# Altium schematic sheet LED_Controller_Power.SchDoc
size A4
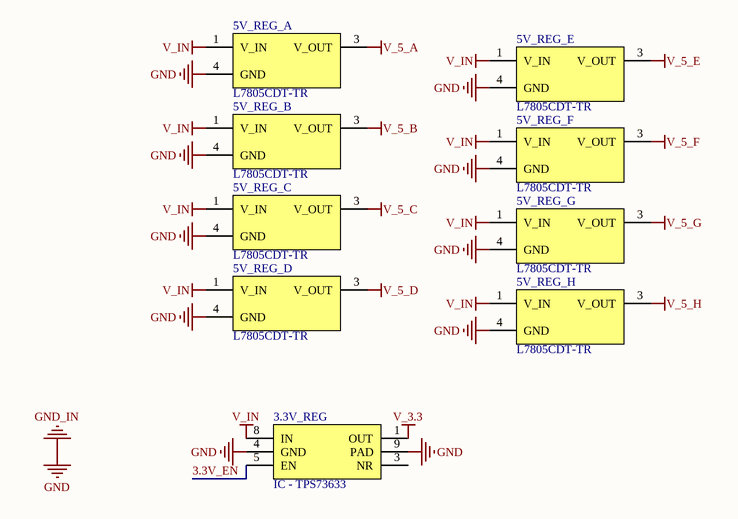
[diagram p0: LED_Controller_Power.SchDoc]

## Parts
3.3V_REG  IC - TPS73633  [TI - DRB / QFN65P300X300X100-8L]
5V_REG_A  L7805CDT-TR  [TO228P973X240-3N]
5V_REG_B  L7805CDT-TR  [TO228P973X240-3N]
5V_REG_C  L7805CDT-TR  [TO228P973X240-3N]
5V_REG_D  L7805CDT-TR  [TO228P973X240-3N]
5V_REG_E  L7805CDT-TR  [TO228P973X240-3N]
5V_REG_F  L7805CDT-TR  [TO228P973X240-3N]
5V_REG_G  L7805CDT-TR  [TO228P973X240-3N]
5V_REG_H  L7805CDT-TR  [TO228P973X240-3N]

## Nets
GND: 3.3V_REG.4(GND) 3.3V_REG.9(PAD) 5V_REG_A.4(GND) 5V_REG_B.4(GND) 5V_REG_C.4(GND) 5V_REG_D.4(GND) 5V_REG_E.4(GND) 5V_REG_F.4(GND) 5V_REG_G.4(GND) 5V_REG_H.4(GND)  [also labelled GND_IN]
V_3.3: 3.3V_REG.1(OUT)
V_5_A: 5V_REG_A.3(V_OUT)
V_5_B: 5V_REG_B.3(V_OUT)
V_5_C: 5V_REG_C.3(V_OUT)
V_5_D: 5V_REG_D.3(V_OUT)
V_5_E: 5V_REG_E.3(V_OUT)
V_5_F: 5V_REG_F.3(V_OUT)
V_5_G: 5V_REG_G.3(V_OUT)
V_5_H: 5V_REG_H.3(V_OUT)
V_IN: 3.3V_REG.8(IN) 5V_REG_A.1(V_IN) 5V_REG_B.1(V_IN) 5V_REG_C.1(V_IN) 5V_REG_D.1(V_IN) 5V_REG_E.1(V_IN) 5V_REG_F.1(V_IN) 5V_REG_G.1(V_IN) 5V_REG_H.1(V_IN)
3.3V_EN: 3.3V_REG.5(EN)

Not connected (* = marked no-connect by the designer): 3.3V_REG 3(NR)

## Library data of the parts
3.3V_REG = IC - TPS73633: IC LDO REG 400MA NO CAP 8-SON; Manufacturer: Texas Instruments; Manufacturer Part Number: TPS73633DRBR; Regulator Topology: Positive Fixed; Voltage - Output: 3.3V; Voltage - Input: Up to 5.5V; Voltage - Dropout (Typical): 0.075V @ 400mA; Number of Regulators: 1; Current - Output: 400mA (Max); Supplier 1: Digi-Key; RoHS: RoHS Compliant; Category: Integrated Circuits (ICs); Stock 1: 6005; Pricing 1: 1=3.15, 25=2.43, 100=2.205, 250=1.98, 500=1.71, 1000=1.44 (USD); Current - Limit (Min): 400mA; Operating Temperature: -40°C ~ 125°C; Mounting Type: Surface Mount; Package / Case: 8-VDFN Exposed Pad; Supplier Device Package: 8-SON Exposed Pad (3x3); Packaging: Cut Tape (CT); ComponentLink1URL: http://focus.ti.com/lit/ds/symlink/tps73601.pdf; ComponentLink1Description: http://focus.ti.com/lit/ds/symlink/tps73601.pdf; Supplier Part Number 1: 296-17884-1-ND
5V_REG_A 5V_REG_B 5V_REG_C 5V_REG_D 5V_REG_E 5V_REG_F 5V_REG_G 5V_REG_H = IC - L7805CDT-TR: IC REG POS 1.5A 5V PREC DPAK; Manufacturer: STMicroelectronics; Regulator Topology: Positive Fixed; Voltage - Input: Up to 35V; Voltage - Dropout (Typical): 2V @ 1A; Number of Regulators: 1; Supplier 1: Digi-Key; Manufacturer Part Number: L7805CDT-TR; RoHS: RoHS Compliant; Category: Integrated Circuits (ICs); Stock 1: 149311; Pricing 1: 1=0.91, 10=0.783, 100=0.618, 250=0.5356, 500=0.4532, 1000=0.3605 (USD); Voltage - Output: 5V; Current - Output: 1.5A; Current - Limit (Min): -; Operating Temperature: 0°C ~ 125°C; Mounting Type: Surface Mount; Package / Case: TO-252-3, DPak (2 Leads + Tab), SC-63; Supplier Device Package: D-Pak; Packaging: Cut Tape (CT); ComponentLink1URL: http://www.st.com/internet/com/TECHNICAL_RESOURCES/TECHNICAL_LITERATURE/DATASHEET/CD00000444.pdf; ComponentLink1Description: http://www.st.com/internet/com/TECHNICAL_RESOURCES/TECHNICAL_LITERATURE/DATASHEET/CD00000444.pdf; Supplier Part Number 1: 497-7255-1-ND